# Altium project keeb.PrjPcb
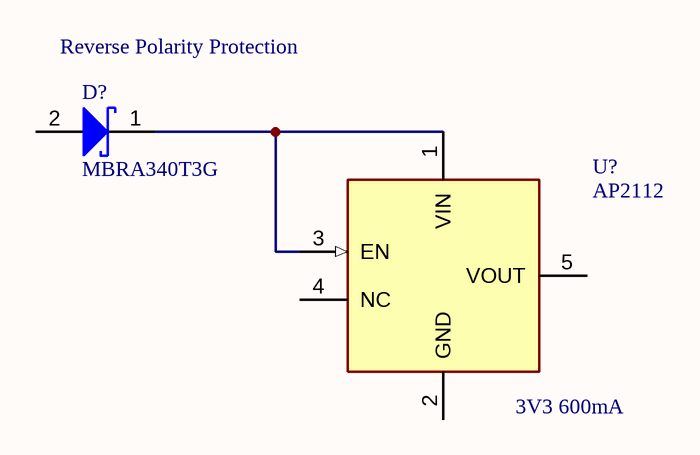
[diagram p0: Sheet1.SchDoc]
DESIGN_OFFICE_PHONE: XXXXX-XXXXXX; ENGINEER: BILL; PCB_ENGINEER: BOB; PCB_FINISH: ENIG TO IPC-4552; PCB_ISSUE_DATE: 31/10/2018; PCB_LAYER_COUNT: 2 LAYERS; PCB_MATERIAL: FR4 UL94VO; PCB_NUMBER: 20000004-Rev1; PCB_RESIST_COLOUR: GREEN; PCB_REVISION: Rev1; PCB_SILK_COLOUR: WHITE; PCB_THICKNESS: 1.6mm; TITLE: TEST PROJECT 1
1 sheet, 2 parts. Net scope: hierarchical (ports join the sheet entries above them; power ports are global).
Board file: keeb.PcbDoc

## Sheet Sheet1.SchDoc: SHEET 1
size A3; Date: 30/10/18; Author: GM; DocumentNumber: 200nnnn1; Revision: A; SheetNumber: 3; SheetTotal: n; SheetDescription: SCHEMATIC TEMPLATE TEST

### Parts
D?  MBRA340T3G  [ONSC-SMA-2-403D-02_F_V]
U?  value AP2112  [SOT25-IPC_A]  (hidden comment: AP2112K-3.3TRG1)

### Nets
NetD?_1: D?.1(K) U?.1(VIN) U?.3(EN)

Not connected (* = marked no-connect by the designer): D? 2(A); U? 2(GND) 4(NC) 5(VOUT)

### Notes on the sheet
- (near D?) Reverse Polarity Protection
- (near U?) 3V3 600mA
- 1
- 2
- 3
- 4
- 5
- 6
- 7
- 8
- A
- B
- C
- D
- E
- F
- PART NUMBER
- DRAWN
- DESCRIPTION
- CHECKED
- APPROVED
- DATE OF ISSUE
- SCALE
- N.T.S
- SIZE
- A3
- SHEET
- REV
- of
- This document has been created for © Ocado Operating Limited ("Ocado"). All intellectual property in
- this document belongs to Ocado Operating Limited ("Ocado"). This document is confidential and is
- supplied on the express condition that it shall not be used (which includes copying, licencing and
- disclosing) by any other person/company without the prior written consent of Ocado. All rights reserved
- All dimensions are in 'mm' unless otherwise stated. If in doubt, ask. DO NOT SCALE FROM DRAWING
- Variant Name

### Library data of the parts
D? = Schottky Power Rectifier, 2-Pin SMA, Pb-Free, Tape and Reel: Manufacturer: ON Semiconductor; Ocado PN: 10X0000028; Rating: 3A; Voltage: 40V; ADDED BY: BT-29APR2021; Value: MBRA340T3G; Description: Schottky Power Rectifier, 2-Pin SMA, Pb-Free, Tape and Reel; Package: SMA-2-403D-02_F; ManufacturerPartNo: MBRA340T3G; Temperature: -55C/150C; Datasheet: https://docs.rs-online.com/9ff9/0900766b80dc542f.pdf
U? = LDO Voltage Regulator 3V3, 600mA: IC REG LINEAR 3.3V 600MA SOT25; Manufacturer: Diodes Incorporated; Ocado PN: 10X0000027; Voltage: 6V; ADDED BY: BT-27APR2021; Package: SOT25; ManufacturerPartNo: IC_AP2112K-3V3; Rating: 600mA; Datasheet: https://datasheet.lcsc.com/lcsc/1809192242_Diodes-Incorporated-AP2112K-3-3TRG1_C51118.pdf